# EAGLE design Arduino_XBee_sensing_relays (EAGLE 7.3.0)
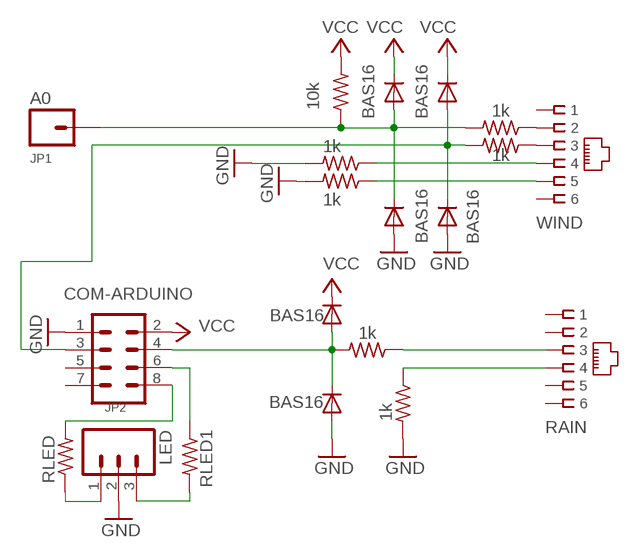
[diagram p0: schematic, sheet 1]

## Parts
A0  JP1  M01PTH  [1X01]
COM-ARDUINO  JP2  M04X2  [2X4]
D1  BAS16  DIODESOD  [SOD-323]
D2  BAS16  DIODESOD  [SOD-323]
D3  BAS16  DIODESOD  [SOD-323]
D4  BAS16  DIODESOD  [SOD-323]
D5  BAS16  DIODESOD  [SOD-323]
D6  BAS16  DIODESOD  [SOD-323]
LED  M03PTH  [1X03]
R1  1k  R-US_M0805  [M0805]
R2  10k  R-US_M0805  [M0805]
R3  1k  R-US_M0805  [M0805]
R4  1k  R-US_M0805  [M0805]
R5  1k  R-US_M0805  [M0805]
R7  1k  R-US_M0805  [M0805]
R8  1k  R-US_M0805  [M0805]
RAIN  RAIN  RJ11-2X  [RJ11-NO_SHIELD]
RLED  R-US_M0805  [M0805]
RLED1  R-US_M0805  [M0805]
WIND  WIND  RJ11-2X  [RJ11-NO_SHIELD]

## Nets
GND: COM-ARDUINO.1 D2.2(A) D4.2(A) D6.2(A) LED.2 R4.2 R5.2 R8.2
N$3: COM-ARDUINO.4 D5.2(A) D6.1(C) R7.2
N$7: LED.1 RLED.1
N$8: R1.1 WIND.2
N$9: R7.1 RAIN.3
N$10: A0.1 D1.2(A) D2.1(C) R1.2 R2.1
N$12: LED.3 RLED1.2
N$13: COM-ARDUINO.6 RLED1.1
N$14: COM-ARDUINO.8 RLED.2
N$15: COM-ARDUINO.3 D3.2(A) D4.1(C) R3.2
N$16: R4.1 WIND.4
N$17: R5.1 WIND.5
N$18: R8.1 RAIN.4
N$19: R3.1 WIND.3
VCC: COM-ARDUINO.2 D1.1(C) D3.1(C) D5.1(C) R2.2
Unconnected: COM-ARDUINO.5 COM-ARDUINO.7 RAIN.1 RAIN.2 RAIN.5 RAIN.6 WIND.1 WIND.6

## Library data of the parts
A0 = SparkFun-Connectors:M01: Header 1 Standard 1-pin 0.1" header. Use with straight break away headers (SKU : PRT-00116), right angle break away headers (PRT-00553), swiss pins (PRT-00743), machine pins (PRT-00117), and female headers (PRT-00115).
COM-ARDUINO = SparkFun-Connectors:M04X2: .1" header, two rows of four.
D1-D6 = SparkFun-DiscreteSemi:DIODE: Diode These are standard reverse protection diodes and small signal diodes. SMA package can handle up to about 1A. SOD-323 can handle about 200mA. What the SOD-323 package when ordering, there are some mfgs out there that are 5-pin packages.; PROD_ID: DIO-09646
LED = SparkFun-Connectors:M03: Header 3 Standard 3-pin 0.1" header. Use with straight break away headers (SKU : PRT-00116), right angle break away headers (PRT-00553), swiss pins (PRT-00743), machine pins (PRT-00117), and female headers (PRT-00115). Molex polarized connector foot print use with SKU : PRT-08232 with associated crimp pins and housings.
R1-R5 R7 R8 RLED RLED1 = rcl:R-US_: RESISTOR, American symbol
RAIN WIND = con-tycoelectronics:RJ11: CORCOM Modular RJ Jacks No Shield Source: www.tycoelectronics.com .. ENG_DS_1654001_1099_RJ_L_0507.pdf; OC_FARNELL: unknown; OC_NEWARK: unknown

## Board
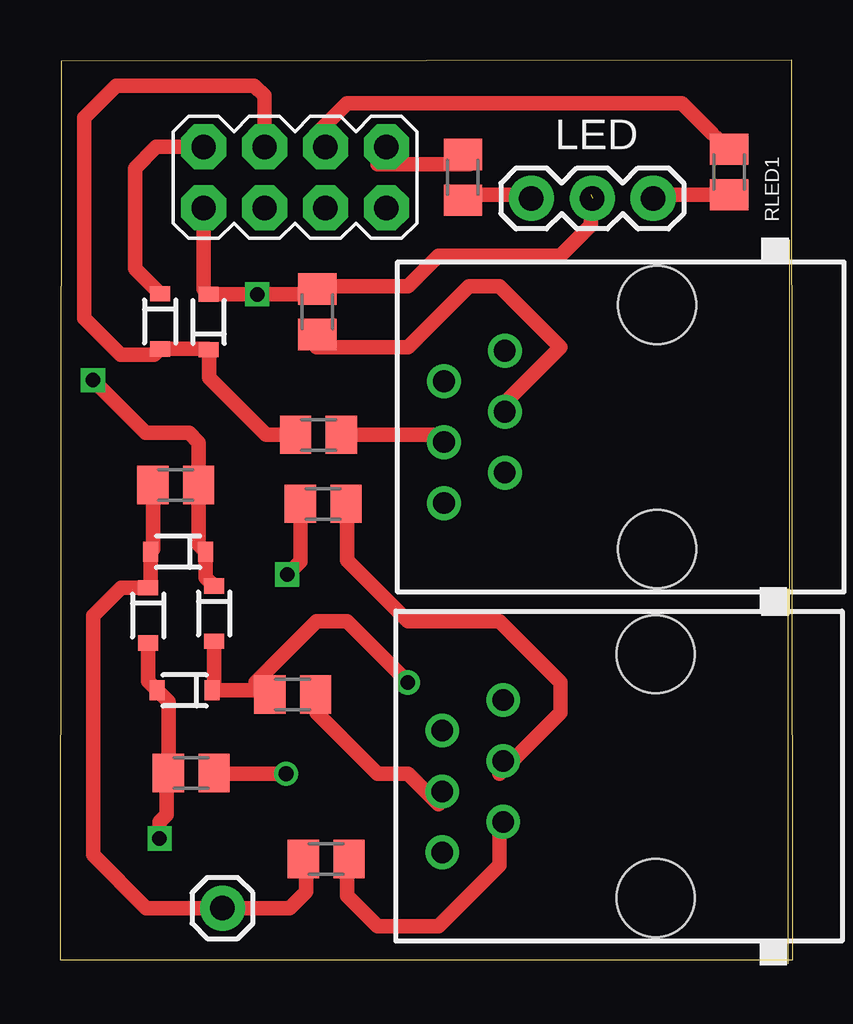
[diagram p1: board, top side]
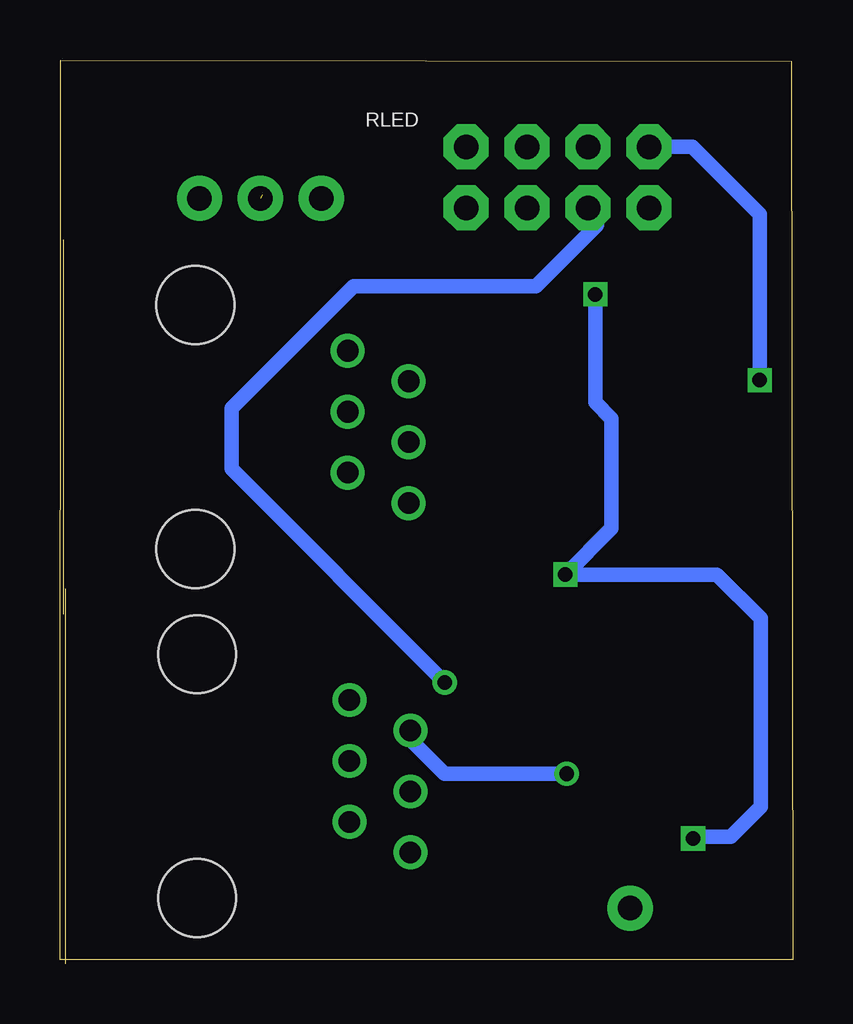
[diagram p2: board, bottom side, seen from below]

Size 30.55 x 37.49 mm. Coordinates in mm from the lower left corner, seen from the top.
Outline: 0,0 30.55,0 30.52,37.49 0.05,37.45 0,0
Copper layers (1*16): Top 0.035mm / dielectric 1.5mm / Bottom 0.035mm
Design rules "default": minimum track width 0.6mm, minimum drill 24mil, track to track 20mil, track to pad 20mil, pad to pad 20mil, via to via 20mil, smd to smd 8mil, copper to edge 40mil, drill to drill 8mil, minimum pad ring 10mil, minimum via ring 8mil, stop-mask expansion 4mil, vias tented up to drill 0mil, thermal gap 10mil

### Footprints (pad centres in the part's own frame; a part is rotated, then mirrored left to right if it is on the bottom)
1X01 = drill 1.016 pad 1.88: 1 0,0
2X4 = drill 1.016 pad 1.88 octagon: 1 -3.81,-1.27; 2 -3.81,1.27; 3 -1.27,-1.27; 4 -1.27,1.27; 5 1.27,-1.27; 6 1.27,1.27; 7 3.81,-1.27; 8 3.81,1.27
SOD-323 = smd 0.63 x 0.83: 1 -1.15,0; 2 1.15,0
1X03 = drill 1.016 pad 1.88: 1 0,0; 2 2.54,0; 3 5.08,0
M0805 = smd 1.3 x 1.6: 1 -0.95,0; 2 0.95,0
RJ11-NO_SHIELD = drill 0.9 pad 1.4: 1 -3.175,8.89; 2 -1.905,6.35; 3 -0.635,8.89; 4 0.635,6.35; 5 1.905,8.89; 6 3.175,6.35 | hole 3.251: -5.08,0; 5.08,0

### Placement (x,y rotation side)
A0  6.78,2.15 0 top
COM-ARDUINO  9.8,32.6 0 top
D1  4.92,17.01 180 top
D2  3.67,14.35 270 top
D3  6.42,14.43 270 top
D4  5.2,11.23 180 top
D5  4.17,26.6 270 top
D6  6.2,26.58 90 top
LED  19.65,31.73 0 top
R1  11.1,4.21 180 top
R2  4.83,19.78 0 top
R3  9.7,11.06 180 top
R4  10.97,19.01 180 top
R5  5.47,7.78 180 top
R7  10.78,21.88 180 top
R8  10.72,27 90 top
RAIN  24.9,22.2 90 top
RLED  16.8,32.6 90 top
RLED1  27.9,32.83 270 top
WIND  24.82,7.65 90 top

### Tracks (layer width: path | path; a pad name or v marks a point on that pad's centre or on a via)
GND  (via drill 0.6)  (1 unrouted)
  Top 0.6: 22.12,31.88 22.12,30.61 20.85,29.34 15.78,29.34 14.51,28.07 10.7,28.07 R8.2
  Top 0.61: D2.2 3.67,11.6 D4.2 4.53,10.76 R5.2 4.45,7.71 4.45,6.06 4.15,5.76 v4.15,5.06 | COM-ARDUINO.1 5.99,27.94 D6.2 v8.22,27.73 10.5,27.73 R8.2 | R4.2 10.03,16.6 v9.47,16.05
  Bottom 0.61: v4.15,5.06 4.08,5.13 2.58,5.13 1.33,6.38 1.33,14.23 3.15,16.05 v9.47,16.05 7.55,17.98 7.55,22.55 8.22,23.23 v8.22,27.73
N$3
  Top 0.61: COM-ARDUINO.4 8.53,36 8.1,36.43 2.35,36.43 1,35.08 1,26.73 2.53,25.2 3.92,25.2 D5.2 6.17,25.45 D6.1 6.22,25.41 6.22,24.25 8.6,21.88 R7.2
N$7
  Top 0.6: RLED.1 17.05,31.88 19.59,31.88 LED.1
N$8
  Top 0.6: R1.1 11.97,3.95 11.97,2.68 13.24,1.4 15.78,1.4 18.31,3.95 18.31,5.22 WIND.2
N$9
  Top 0.61: R7.1 15.7,21.88 RAIN.3
N$10
  Top 0.61: R2.1 3.88,17.1 D1.2 3.78,15.6 D2.1 2.55,15.51 1.38,14.33 1.38,4.38 3.6,2.15 A0.1 9.58,2.15 10.25,2.83 10.25,4.11 R1.2
N$12
  Top 0.6: RLED1.2 27.2,31.88 24.66,31.88 LED.3
N$13
  Top 0.6: RLED1.1 27.2,34.42 25.93,35.7 11.97,35.7 10.7,34.42 COM-ARDUINO.6
N$14
  Top 0.6: RLED.2 17.05,33.16 13.24,33.16 COM-ARDUINO.8
N$15  (via drill 0.61)
  Top 0.6: v14.51,11.56 11.97,14.1 10.7,14.1 8.15,11.56 R3.2
  Top 0.61: D3.2 6.42,11.31 D4.1 8.58,11.23 R3.2
  Bottom 0.6: v14.51,11.56 23.39,20.45 23.39,22.99 18.31,28.07 10.7,28.07 8.15,30.61 COM-ARDUINO.3
N$16
  Top 0.6: R4.1 11.97,19.19 11.97,16.65 14.51,14.1 18.31,14.1 20.85,11.56 20.85,10.29 18.31,7.76 WIND.4
N$17  (via drill 0.61)
  Top 0.6: v9.42,7.76 6.88,7.76 R5.1
  Bottom 0.6: v9.42,7.76 14.51,7.76 15.78,9.03 WIND.5
N$18
  Top 0.6: R8.1 10.7,25.53 14.51,25.53 17.05,28.07 18.31,28.07 20.85,25.53 18.31,22.99 RAIN.4
N$19
  Top 0.6: R3.1 10.7,10.29 13.24,7.76 14.51,7.76 15.78,6.49 WIND.3
VCC  (via drill 0.6)
  Top 0.61: D3.1 6.08,15.93 D1.1 5.78,17.3 R2.2 5.78,21.55 5.38,21.95 3.58,21.95 v1.38,24.16 | COM-ARDUINO.2 4.02,33.88 3.13,32.98 3.13,28.8 D5.1
  Bottom 0.61: v1.38,24.16 1.38,31.07 4.17,33.88 COM-ARDUINO.2